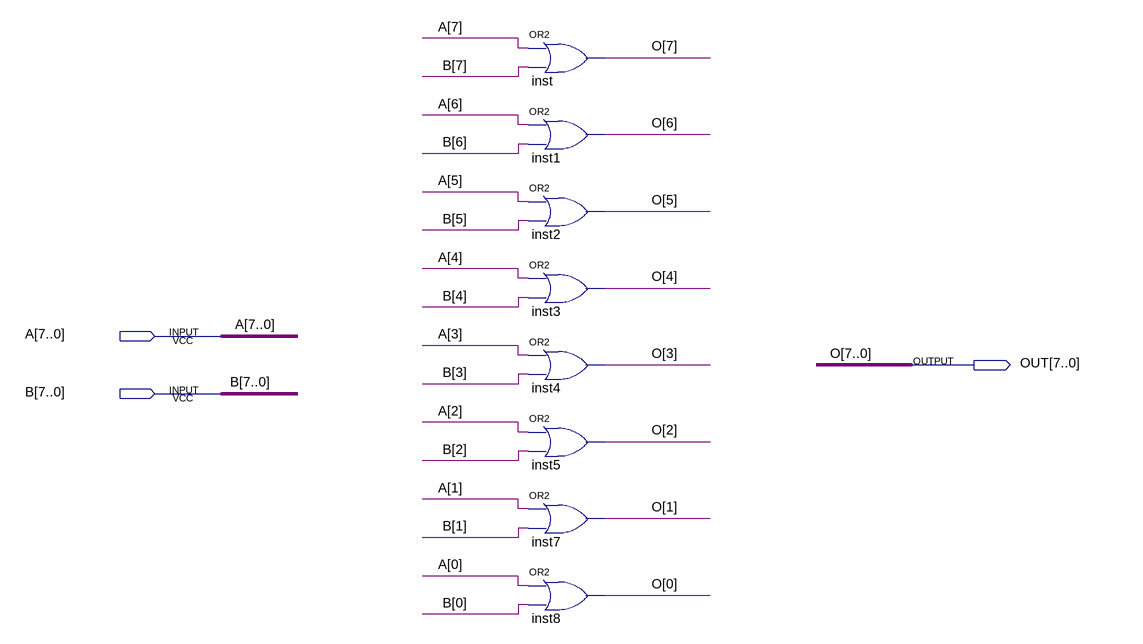
[diagram p0: schematic sheet]
// Quartus schematic OR_8BIT.bdf as structural Verilog: 8 symbols, 3 pins
module OR_8BIT (
  input  [7:0] A,
  input  [7:0] B,
  output [7:0] OUT
);

  or inst (OUT[7], A[7], B[7]);
  or inst1 (OUT[6], A[6], B[6]);
  or inst2 (OUT[5], A[5], B[5]);
  or inst3 (OUT[4], A[4], B[4]);
  or inst4 (OUT[3], A[3], B[3]);
  or inst5 (OUT[2], A[2], B[2]);
  or inst7 (OUT[1], A[1], B[1]);
  or inst8 (OUT[0], A[0], B[0]);

  // Other names for the same wires on the sheet: O[7:0] = OUT
endmodule
